# EAGLE schematic PIC32 (EAGLE 7.5.0)
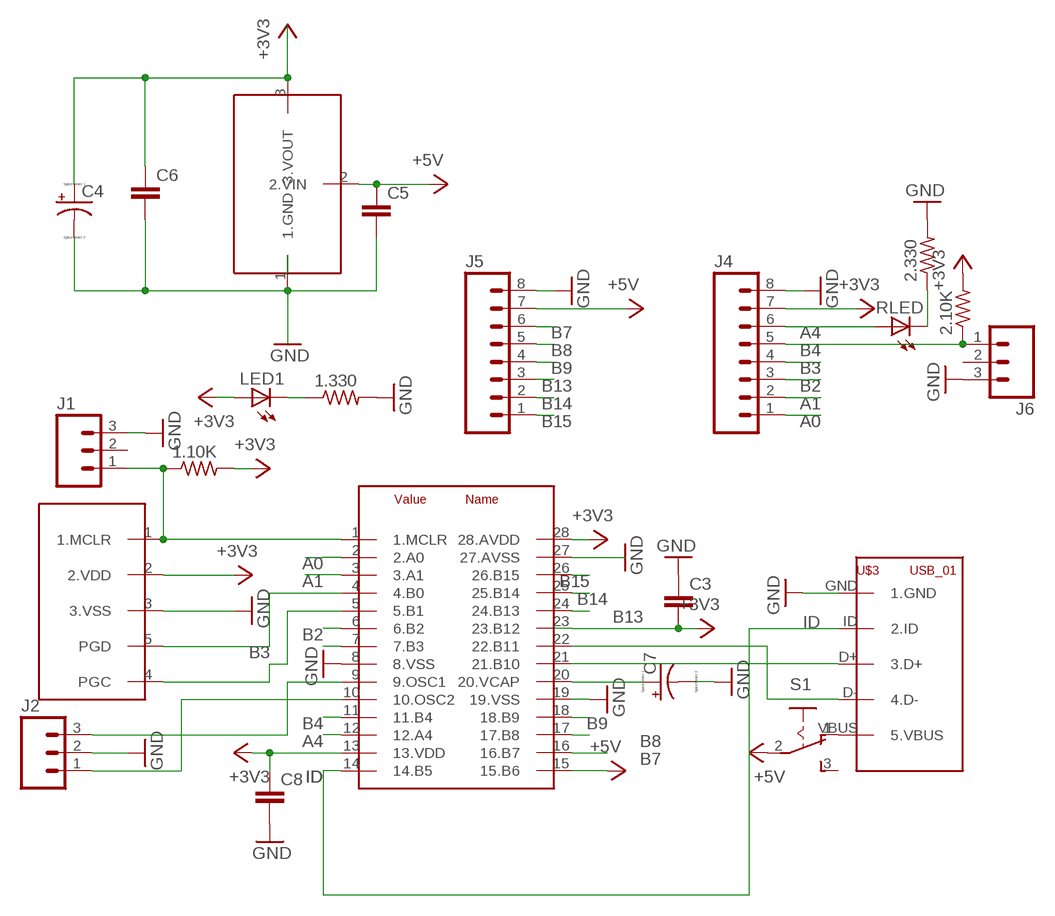
[diagram p0: schematic, sheet 1]

## Parts
1.10K  R-US_0207/10  [0207/10]
1.330  R-US_0207/10  [0207/10]
2.10K  R-US_0207/10  [0207/10]
2.330  R-US_0207/10  [0207/10]
C3  C5/3  [C5B3]
C4  CPOL-USB45181B  [B45181B]
C5  C5/3  [C5B3]
C6  C5/3  [C5B3]
C7  CPOL-USB45181B  [B45181B]
C8  C5/3  [C5B3]
J1  M03PTH  [1X03]
J2  M03PTH  [1X03]
J4  M08  [1X08_ROUND]
J5  M08  [1X08_ROUND]
J6  M03PTH  [1X03]
LED1  LED3MM  [LED3MM]
RLED  LED3MM  [LED3MM]
S1  255SB  [255SB]
U$1  PIC28  [DIL28-3]
U$2  MCP1702  [TO92]
U$3  USB_01  [USB-MB-H]
U$5  SWITCH_M05  [1X05]

## Nets
+3V3: 1.10K.2 2.10K.2 C3.2 C8.1 J4.7 LED1.A U$1.13(13.VDD) U$1.23(23.B12) U$1.28(28.AVDD) U$5.2(2.VDD)
+5V: C5.1 J5.7 S1.2(P) U$1.15(15.B6) U$2.2(2.VIN)
A0: J4.1 U$1.2(2.A0)
A1: J4.2 U$1.3(3.A1)
A4: J4.6 RLED.A U$1.12(12.A4)
B2: J4.3 U$1.6(6.B2)
B3: J4.4 U$1.7(7.B3)
B4: 2.10K.1 J4.5 J6.1 U$1.11(11.B4)
B7: J5.6 U$1.16(16.B7)
B8: J5.5 U$1.17(17.B8)
B9: J5.4 U$1.18(18.B9)
B13: J5.3 U$1.24(24.B13)
B14: J5.2 U$1.25(25.B14)
B15: J5.1 U$1.26(26.B15)
GND: 1.330.2 2.330.2 C3.1 C7.- C8.2 J1.3 J2.2 J4.8 J5.8 J6.3 U$1.8(8.VSS) U$1.19(19.VSS) U$3.GND(1.GND) U$5.3(3.VSS)
ID: U$1.14(14.B5) U$3.ID(2.ID)
N$2: S1.1(O) U$3.VBUS(5.VBUS)
N$3: C4.- C5.2 C6.2 U$2.1(1.GND)
N$4: C4.+ C6.1 U$2.3(3.VOUT)
N$5: U$1.27(27.AVSS)
N$6: U$1.5(5.B1) U$5.4(PGC)
N$7: U$1.4(4.B0) U$5.5(PGD)
N$9: J2.3 U$1.9(9.OSC1)
N$10: J2.1 U$1.10(10.OSC2)
N$11: C7.+ U$1.20(20.VCAP)
N$12: U$1.22(22.B11) U$3.D-(4.D-)
N$13: U$1.21(21.B10) U$3.D+(3.D+)
N$14: 1.330.1 LED1.K(C)
N$15: 1.10K.1 J1.1 U$1.1(1.MCLR) U$5.1(1.MCLR)
N$29: 2.330.1 RLED.K(C)
Unconnected: J1.2 J6.2 S1.3(S)

## Library data of the parts
1.10K 1.330 2.10K 2.330 = ME333:R-US_: RESISTOR, American symbol
C3 C5 C6 C8 = ME333:C: CAPACITOR naming: grid - package width
C4 C7 = ME333:CPOL-US: POLARIZED CAPACITOR, American symbol
J1 J2 J6 = ME333:M03: Header 3 Standard 3-pin 0.1" header. Use with straight break away headers (SKU : PRT-00116), right angle break away headers (PRT-00553), swiss pins (PRT-00743), machine pins (PRT-00117), and female headers (PRT-00115). Molex polarized connector foot print use with SKU : PRT-08232 with associated crimp pins and housings.
J4 J5 = ME333:M08: Header 8 Standard 8-pin 0.1" header. Use with straight break away headers (SKU : PRT-00116), right angle break away headers (PRT-00553), swiss pins (PRT-00743), machine pins (PRT-00117), and female headers (PRT-00115).; PROD_ID: CONN-08437
LED1 RLED = ME333:LED: LED OSRAM: - CHIPLED LG R971, LG N971, LY N971, LG Q971, LY Q971, LO R971, LY R971 LH N974, LH R974 LS Q976, LO Q976, LY Q976 LO Q996 - Hyper CHIPLED LW Q18S LB Q993, LB Q99A, LB R99A - SideLED LS A670, LO A670, LY A670, LG A670, LP A670 LB A673, LV A673, LT A673, LW A673 LH A674 LY A675 LS A676, LA A676, LO A676, LY A676, LW A676 LS A679, LY A679, LG A679 - Hyper Micro SIDELED® LS Y876, LA Y876, LO Y876, LY Y876 LT Y87S - SmartLED LW L88C, LW L88S LB L89C, LB L89S, LG L890 LS L89K, LO L89K, LY L89K LS L896, LA L896, LO L896, LY L896 - TOPLED LS T670, LO T670, LY T670, LG T670, LP T670 LSG T670, LSP T670, LSY T670, LOP T670, LYG T670 LG T671, LOG T671, LSG T671 LB T673, LV T673, LT T673, LW T673 LH T674 LS T676, LA T676, LO T676, LY T676, LB T676, LH T676, LSB T676, LW T676 LB T67C, LV T67C, LT T67C, LS T67K, LO T67K, LY T67K, LW E67C LS E67B, LA E67B, LO E67B, LY E67B, LB E67C, LV E67C, LT E67C LW T67C LS T679, LY T679, LG T679 LS T770, LO T770, LY T770, LG T770, LP T770 LB T773, LV T773, LT T773, LW T773 LH T774 LS E675, LA E675, LY E675, LS T675 LS T776, LA T776, LO T776, LY T776, LB T776 LHGB T686 LT T68C, LB T68C - Hyper Mini TOPLED® LB M676 - Mini TOPLED Santana® LG M470 LS M47K, LO M47K, LY M47K Source: http://www.osram.convergy.de LUXEON: - LUMILED® LXK2-PW12-R00, LXK2-PW12-S00, LXK2-PW14-U00, LXK2-PW14-V00 LXK2-PM12-R00, LXK2-PM12-S00, LXK2-PM14-U00 LXK2-PE12-Q00, LXK2-PE12-R00, LXK2-PE12-S00, LXK2-PE14-T00, LXK2-PE14-U00 LXK2-PB12-K00, LXK2-PB12-L00, LXK2-PB12-M00, LXK2-PB14-N00, LXK2-PB14-P00, LXK2-PB14-Q00 LXK2-PR12-L00, LXK2-PR12-M00, LXK2-PR14-Q00, LXK2-PR14-R00 LXK2-PD12-Q00, LXK2-PD12-R00, LXK2-PD12-S00 LXK2-PH12-R00, LXK2-PH12-S00 LXK2-PL12-P00, LXK2-PL12-Q00, LXK2-PL12-R00 Source: www.luxeon.com KINGBRIGHT: KA-3528ASYC Source: www.kingbright.com
S1 = HW2LIBRARY:255SB: SLIDING SWITCH Distributor Buerklin, 11G810
U$1 = ME333:PIC28
U$2 = ME333:MCP1702
U$3 = ME333:USB_01
U$5 = ME333:SWITCH_M05